# EasyEDA Pro project ProPrj_arm_can_tool_2026-04-18.epro, schematic Schematic1, sheet 3 of 3

## Sheets
3 P3: Page Name: P3; Update Date: 2026-04-16
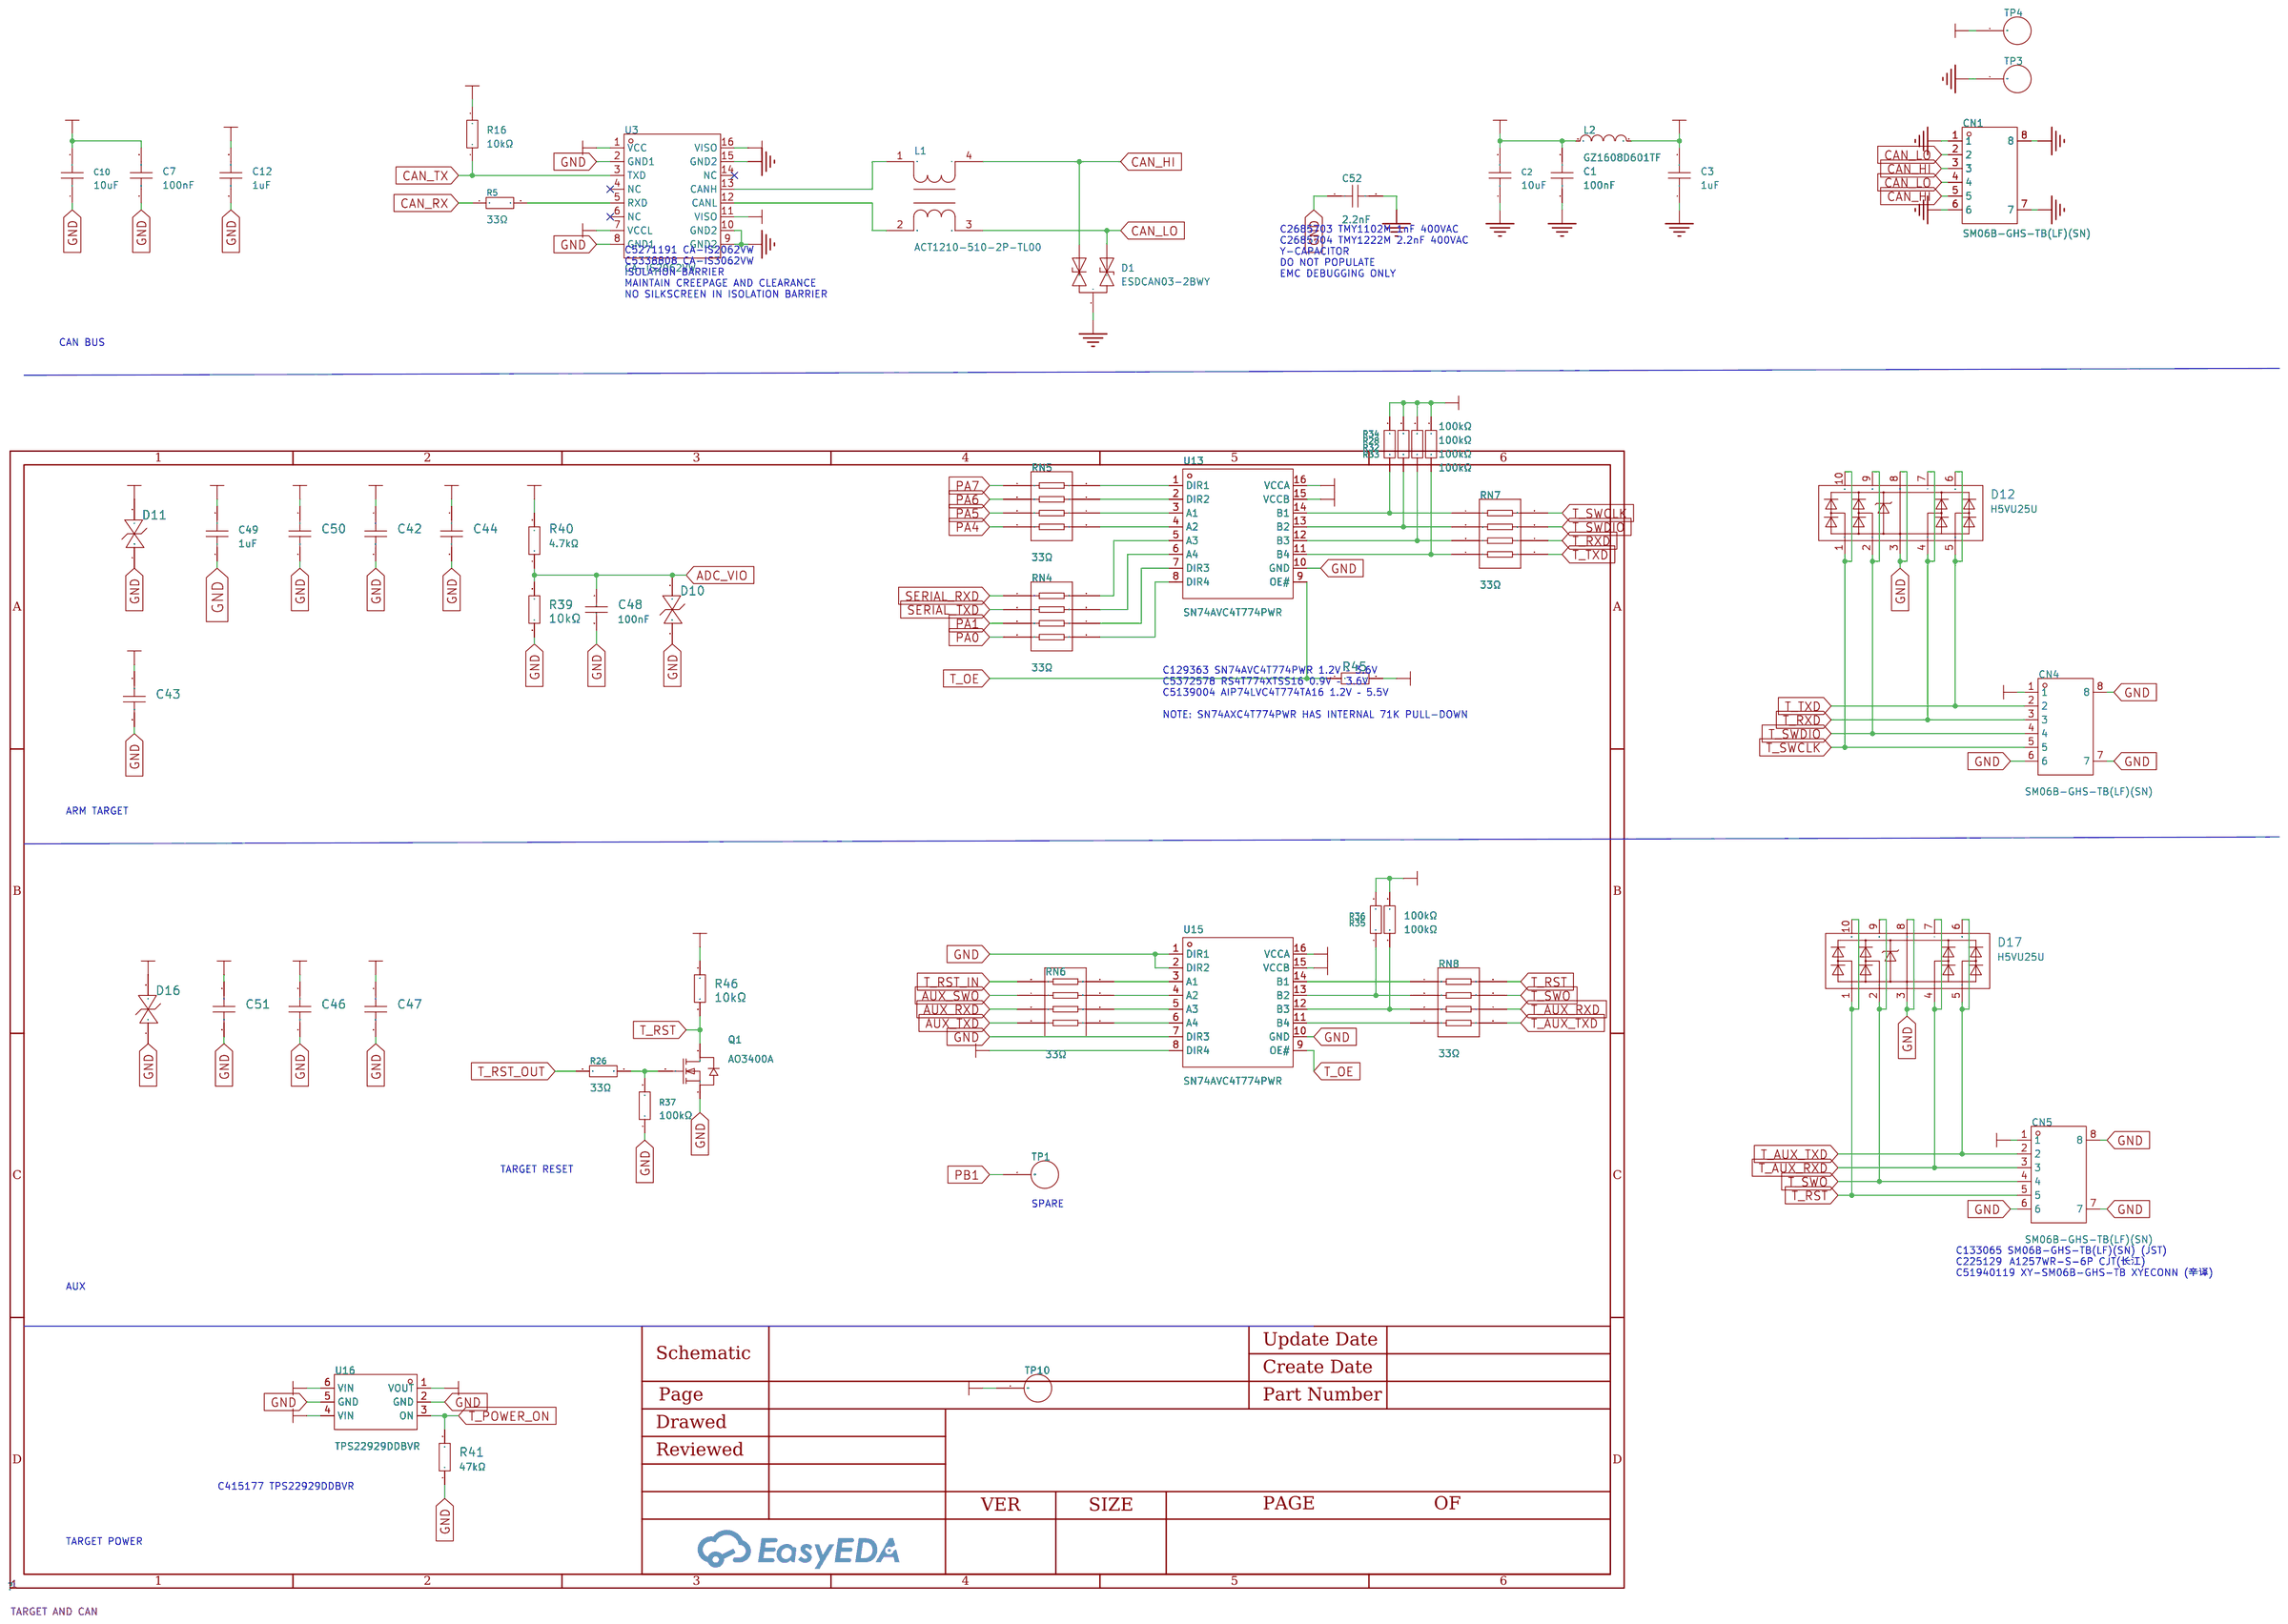
[diagram p2: P3]

## Parts
C1  100nF  [C0603]
C2  10uF  [C0603]
C3  1uF  [C0603]
C7  100nF  [C0603]
C10  10uF  [C0603]
C12  1uF  [C0603]
C42  100nF  [C0402]
C43  100nF  [C0402]
C44  100nF  [C0402]
C46  100nF  [C0402]
C47  100nF  [C0402]
C48  100nF  [C0402]
C49  1uF  [C0402]
C50  100nF  [C0402]
C51  100nF  [C0402]
C52  2.2nF  [CAP-SMD_L7.8-W5.4-P9.60_TMY1222M]  (no BOM)
CN1  SM06B-GHS-TB(LF)(SN)  [CONN-TH_SM06B-GHS-TB-LF-SN]
CN4  SM06B-GHS-TB(LF)(SN)  [CONN-TH_SM06B-GHS-TB-LF-SN]
CN5  SM06B-GHS-TB(LF)(SN)  [CONN-TH_SM06B-GHS-TB-LF-SN]
D1  ESDCAN03-2BWY  [SOT-323-3_L2.0-W1.3-P1.30-LS2.1-BR]
D10  H5VL10B  [SOD-882_L1.0-W0.6-BI]
D11  H5VL10B  [SOD-882_L1.0-W0.6-BI]
D12  H5VU25U  [DFN2510-10_L2.5-W1.0-P0.50-BL]
D16  H5VL10B  [SOD-882_L1.0-W0.6-BI]
D17  H5VU25U  [DFN2510-10_L2.5-W1.0-P0.50-BL]
L1  ACT1210-510-2P-TL00  [FILTER-SMD_4P-L3.2-W2.5-BL_ACT1210]
L2  GZ1608D601TF  [L0603]
Q1  AO3400A  [SOT-23-3_L2.9-W1.3-P1.90-LS2.4-BR]
R5  33Ω  [R0402]
R16  10kΩ  [R0402]
R26  33Ω  [R0402]
R28  100kΩ  [R0402]
R32  100kΩ  [R0402]
R33  100kΩ  [R0402]
R34  100kΩ  [R0402]
R35  100kΩ  [R0402]
R36  100kΩ  [R0402]
R37  100kΩ  [R0402]
R39  10kΩ  [R0402]
R40  4.7kΩ  [R0402]
R41  47kΩ  [R0402]
R45  10kΩ  [R0402]
R46  10kΩ  [R0402]
RN4  33Ω  [RES-ARRAY-SMD_0402-8P-L2.0-W1.0-BL]
RN5  33Ω  [RES-ARRAY-SMD_0402-8P-L2.0-W1.0-BL]
RN6  33Ω  [RES-ARRAY-SMD_0402-8P-L2.0-W1.0-BL]
RN7  33Ω  [RES-ARRAY-SMD_0402-8P-L2.0-W1.0-BL]
RN8  33Ω  [RES-ARRAY-SMD_0402-8P-L2.0-W1.0-BL]
TP1  -  [TEST PAD]  (no BOM)
TP3  -  [TEST PAD]  (no BOM)
TP4  -  [TEST PAD]  (no BOM)
TP10  -  [TEST PAD]  (no BOM)
U3  CA-IS2062VW  [CA-IS305XW]
U13  SN74AVC4T774PWR  [TSSOP-16_L5.0-W4.4-P0.65-LS6.4-BL]
U15  SN74AVC4T774PWR  [TSSOP-16_L5.0-W4.4-P0.65-LS6.4-BL]
U16  TPS22929DDBVR  [SOT-23-6_L2.9-W1.6-P0.95-LS2.8-BL]

## Library data of the parts
C1 C7 = CC0603KRX7R9BB104: Capacitance: Tolerance:±10% Tolerance:±10% Voltage Rated: Temperature Coefficient:; LCSC Part Name: 100nF ±10% 50V; Supplier Part: C14663; Manufacturer: YAGEO(国巨); Supplier Footprint: 0603; JLCPCB Part Class: Basic Part; Datasheet: https://atta.szlcsc.com/upload/public/pdf/source/20180910/C282072_33301C7F631E79921B82A8DAC6BCC5B3.pdf; Supplier: LCSC; Tolerance: ±10%; Check: false
C2 C10 = CL10A106MA8NRNC: Capacitance: Tolerance:±20% Tolerance:±20% Voltage Rated: Temperature Coefficient:; LCSC Part Name: 10uF ±20% 25V; Supplier Part: C96446; Manufacturer: SAMSUNG(三星); Supplier Footprint: 0603; JLCPCB Part Class: Basic Part; Datasheet: https://atta.szlcsc.com/upload/public/pdf/source/20160218/1457707763339.pdf; Supplier: LCSC; Tolerance: ±20%; Check: false
C3 C12 = CL10A105KB8NNNC: Capacitance: Tolerance:±10% Tolerance:±10% Voltage Rated: Temperature Coefficient:; LCSC Part Name: 1uF ±10% 50V; Supplier Part: C15849; Manufacturer: SAMSUNG(三星); Supplier Footprint: 0603; JLCPCB Part Class: Basic Part; Datasheet: https://atta.szlcsc.com/upload/public/pdf/source/20160218/1457707763339.pdf; Supplier: LCSC; Tolerance: ±10%; Check: false
C42-C44 C46-C48 C50 C51 = CL05B104KO5NNNC: Capacitance: Tolerance:±10% Tolerance:±10% Voltage Rated: Temperature Coefficient:; LCSC Part Name: 100nF ±10% 16V; Supplier Part: C1525; Manufacturer: SAMSUNG(三星); Supplier Footprint: 0402; JLCPCB Part Class: Basic Part; Datasheet: https://atta.szlcsc.com/upload/public/pdf/source/20160218/1457707763339.pdf; Supplier: LCSC; Tolerance: ±10%; Check: false
C49 = CL05A105KA5NQNC: Capacitance: Tolerance:±10% Tolerance:±10% Voltage Rated: Temperature Coefficient:; LCSC Part Name: 1uF ±10% 25V; Supplier Part: C52923; Manufacturer: SAMSUNG(三星); Supplier Footprint: 0402; JLCPCB Part Class: Basic Part; Datasheet: https://atta.szlcsc.com/upload/public/pdf/source/20160218/1457707763339.pdf; Supplier: LCSC; Tolerance: ±10%; Check: false
C52 = TMY1222M: Capacitance:2.2nF Tolerance:±20% Tolerance:±20% Voltage(AC):400V Ratings:Y1 Operating Temperature:-40℃~+125℃ Operating Temperature:-40℃~+125℃; LCSC Part Name: 等级:Y1 2.2nF ±20% 400V; Supplier Part: C2685704; Manufacturer: TRX(特锐祥); Supplier Footprint: SMD,5.4x7.8mm; JLCPCB Part Class: Extended Part; Datasheet: https://item.szlcsc.com/datasheet/TMY1222M/2785659.html; Supplier: LCSC; Tolerance: ±20%; Voltage(AC): 400V; Ratings: Y1; Operating Temperature: -40℃~+125℃; Check: false
CN1 CN4 CN5 = SM06B-GHS-TB(LF)(SN): Pins Structure:1x6P Pitch:1.25mm Mounting Style:Horizontal attachment Reference Series:GH Number of Pins:6P Number of Rows:1 Number of PINs Per Row:6 Row Spacing:- Current Rating (Max):1A Contact Material:Phosphor Bronze Contact Plating:Tin Operating Temp; LCSC Part Name: 1x6P 间距:1.25mm 卧贴 系列:GH; Supplier Part: C133065; Manufacturer: JST; Supplier Footprint: SMD,P=1.25mm,卧贴; JLCPCB Part Class: Extended Part; Datasheet: https://atta.szlcsc.com/upload/public/pdf/source/20180323/112205B2CF875947C9562BFC7B01FA26.pdf; Supplier: LCSC; Pins Structure: 1x6P; Pitch: 1.25mm; Mounting Style: Horizontal attachment; Reference Series: GH; Number of Pins: 6P; Number of Rows: 1; Number of PINs Per Row: 6; Current Rating (Max): 1A; Contact Material: Phosphor Bronze; Contact Plating: Tin; Operating Temperature Range: -25℃~+85℃; Rated Voltage (Max): 50V; Plastic Material: PA9T; Flame Retardant Rating: UL94V-0; Supplementary Features: Auxiliary soldering legs; Colour: White; Z-Height of the Board: 4.25mm; X-Length of Bottom Edge on Board (Spacing Line): 10.75mm; Y-Width of Bottom Edge on Board: 4.13mm; Check: false
D1 = ESDCAN03-2BWY: Reverse Stand-Off Voltage (Vrwm):24V Maximum Clamping Voltage:41V Peak Pulse Current (Ipp):3A@8/20us Peak Pulse Power Dissipation (Ppp):250W Breakdown Voltage:26.5V Number of Lines:Dual channel Operating Temperature:-55℃~+175℃@(Tj) Operating Temperature:-; LCSC Part Name: ESDCAN03 2BWY; Supplier Part: C1973833; Manufacturer: ST(意法半导体); Supplier Footprint: SOT-323-3; JLCPCB Part Class: Extended Part; Datasheet: https://atta.szlcsc.com/upload/public/pdf/source/20210601/EE22EC2D769ED57BA217B6DB28AAC84F.pdf; Supplier: LCSC; Reverse Stand-Off Voltage (Vrwm): 24V; Maximum Clamping Voltage: 41V; Peak Pulse Current (Ipp): 3A@8/20us; Peak Pulse Power Dissipation (Ppp): 250W; Breakdown Voltage: 26.5V; Number of Lines: Dual channel; Operating Temperature: -55℃~+175℃@(Tj); Type: ESD; Check: false
D10 D11 D16 = H5VL10B: polarity:Bi-Directional Reverse Stand-Off Voltage (Vrwm):5V Maximum Clamping Voltage:10V Peak Pulse Current (Ipp)@10/1000us:5A Peak Pulse Power Dissipation (Ppp)@10/1000us:50W Breakdown Voltage:5.6V Reverse Leakage Current (Ir):100nA Number of Lines:单路 Op; Supplier Part: C7420372; Manufacturer: 宏迦橙; Supplier Footprint: DFN1006-2L; JLCPCB Part Class: Extended Part; Datasheet: https://atta.szlcsc.com/upload/public/pdf/source/20230630/5024ECFEAD3C9801B07A8DBB967AB462.pdf; Supplier: LCSC; polarity: Bi-Directional; Reverse Stand-Off Voltage (Vrwm): 5V; Maximum Clamping Voltage: 10V; Peak Pulse Current (Ipp)@10/1000us: 5A; Peak Pulse Power Dissipation (Ppp)@10/1000us: 50W; Breakdown Voltage: 5.6V; Reverse Leakage Current (Ir): 100nA; Number of Lines: 单路; Operating Temperature: -55℃~+155℃; Type: TVS; Check: false
D12 D17 = H5VU25U: polarity:Unidirectional Reverse Stand-Off Voltage (Vrwm):5V Maximum Clamping Voltage:14V Peak Pulse Current (Ipp)@10/1000us:4A Peak Pulse Power Dissipation (Ppp)@10/1000us:56W Breakdown Voltage:6V Reverse Leakage Current (Ir):1uA Number of Lines:Quad Oper; Supplier Part: C7420374; Manufacturer: 宏迦橙; Supplier Footprint: DFN2510-10L; JLCPCB Part Class: Extended Part; Datasheet: https://atta.szlcsc.com/upload/public/pdf/source/20230630/91FD1DB17AB88B6832D3039FAE61FF10.pdf; Supplier: LCSC; polarity: Unidirectional; Reverse Stand-Off Voltage (Vrwm): 5V; Maximum Clamping Voltage: 14V; Peak Pulse Current (Ipp)@10/1000us: 4A; Peak Pulse Power Dissipation (Ppp)@10/1000us: 56W; Breakdown Voltage: 6V; Reverse Leakage Current (Ir): 1uA; Number of Lines: Quad; Operating Temperature: -55℃~+155℃; Type: TVS; Check: false
L1 = ACT1210-510-2P-TL00: Number of Lines:2 Current Rating:200mA Inductance @ Frequency:51uH@100kHz Voltage Rating - DC:80V Impedance @ Frequency:2.6kΩ@10MHz DC Resistance(DCR):700mΩ Operating Temperature:-55℃~+150℃ Operating Temperature:-55℃~+150℃; LCSC Part Name: 两路 共模滤波器 阻抗2.6kΩ@10MHz; Supplier Part: C95572; Manufacturer: TDK; Supplier Footprint: SMD-4P,3.2x2.5mm; JLCPCB Part Class: Extended Part; Datasheet: https://item.szlcsc.com/datasheet/ACT1210-510-2P-TL00/96776.html; Supplier: LCSC; Number of Lines: 2; Current Rating: 200mA; Inductance @ Frequency: 51uH@100kHz; Voltage Rating - DC: 80V; Impedance @ Frequency: 2.6kΩ@10MHz; DC Resistance(DCR): 700mΩ; Operating Temperature: -55℃~+150℃; Check: false
L2 = GZ1608D601TF: Impedance @ Frequency:600Ω@100MHz Tolerance:±25% Tolerance:±25% DC Resistance:450mΩ Current Rating:200mA Circuits:1; LCSC Part Name: 单路 0603磁珠 阻抗600Ω@100MHz; Supplier Part: C1002; Manufacturer: Sunlord(顺络); Supplier Footprint: 0603; JLCPCB Part Class: Basic Part; Datasheet: https://atta.szlcsc.com/upload/public/pdf/source/20241120/893429B990C3BA07384E734821D2F218.pdf; Supplier: LCSC; Impedance @ Frequency: 600Ω@100MHz; Tolerance: ±25%; DC Resistance: 450mΩ; Current Rating: 200mA; Circuits: 1; Check: false
Q1 = AO3400A_C20917: Type:1 N-Channel Drain Source Voltage (Vdss): Continuous Drain Current (Id): Power Dissipation (Pd): Drain Source On Resistance (RDS(on)@Vgs,Id):26.5mΩ@10V,5.7A Gate Threshold Voltage (Vgs(th)@Id):1.5V@250uA Total Gate Charge (Qg@Vgs):7nC@4.5V Input Capac; LCSC Part Name: 1个N沟道 耐压:30V 电流:5.7A; Supplier Part: C20917; Manufacturer: AOS; Supplier Footprint: SOT-23-3L; JLCPCB Part Class: Basic Part; Datasheet: https://atta.szlcsc.com/upload/public/pdf/source/20140107/1457706668533.pdf; Supplier: LCSC; Type: 1 N-Channel; Drain Source On Resistance (RDS(on)@Vgs,Id): 26.5mΩ@10V,5.7A; Gate Threshold Voltage (Vgs(th)@Id): 1.5V@250uA; Total Gate Charge (Qg@Vgs): 7nC@4.5V; Input Capacitance (Ciss@Vds): 630pF@15V; Operating Temperature: -55℃~+150℃@(Tj); Check: false
R5 R26 = 0402WGF330JTCE: Type:Thick Film Resistors Resistance:33Ω Tolerance:±1% Tolerance:±1% Power(Watts): Overload Voltage (Max): Temperature Coefficient:±100ppm/℃ Temperature Coefficient:±100ppm/℃ Operating Temperature Range:-55℃~+155℃ Operating Temperature Range:-55℃~+155℃; LCSC Part Name: 33Ω ±1% 62.5mW 厚膜电阻; Supplier Part: C25105; Manufacturer: UNI-ROYAL(厚声); Supplier Footprint: 0402; JLCPCB Part Class: Basic Part; Datasheet: https://atta.szlcsc.com/upload/public/pdf/source/20200306/C422600_1E6D84923E4A46A82E41ADD87F860B5C.pdf; Supplier: LCSC; Type: Thick Film Resistors; Tolerance: ±1%; Temperature Coefficient: ±100ppm/℃; Operating Temperature Range: -55℃~+155℃; Check: false
R16 R45 = 0402WGF1002TCE: Type:Thick Film Resistor Resistance:10kΩ Tolerance:±1% Tolerance:±1% Power(Watts):62.5mW Voltage-Supply(Max):50V Temperature Coefficient:±100ppm/℃ Temperature Coefficient:±100ppm/℃ Operating Temperature:-55℃~+155℃ Operating Temperature:-55℃~+155℃; LCSC Part Name: 10kΩ ±1% 62.5mW 厚膜电阻; Supplier Part: C25744; Manufacturer: UNI-ROYAL(厚声); Supplier Footprint: 0402; JLCPCB Part Class: Basic Part; Datasheet: https://item.szlcsc.com/datasheet/0402WGF1002TCE/26487.html; Supplier: LCSC; Tolerance: ±1%; Power(Watts): 62.5mW; Temperature Coefficient: ±100ppm/℃; Type: Thick Film Resistor; Operating Temperature Range: -55℃~+155℃; Voltage-Supply(Max): 50V; Operating Temperature: -55℃~+155℃; Check: false
R28 R32-R37 = 0402WGF1003TCE: Resistance:100000Ω Tolerance:±1% Tolerance:±1% Power(Watts): Overload Voltage (Max): Temperature Coefficient:±100ppm/℃ Temperature Coefficient:±100ppm/℃ Type:Thick Film Resistors Operating Temperature Range:-55℃~+155℃ Operating Temperature Range:-55℃~+155; LCSC Part Name: 100kΩ ±1% 62.5mW 厚膜电阻; Supplier Part: C25741; Manufacturer: UNI-ROYAL(厚声); Supplier Footprint: 0402; JLCPCB Part Class: Basic Part; Datasheet: https://atta.szlcsc.com/upload/public/pdf/source/20200306/C422600_1E6D84923E4A46A82E41ADD87F860B5C.pdf; Supplier: LCSC; Tolerance: ±1%; Temperature Coefficient: ±100ppm/℃; Type: Thick Film Resistors; Operating Temperature Range: -55℃~+155℃; Check: false
R39 R46 = 0402WGF1002TCE: Type:Thick Film Resistor Resistance:10kΩ Tolerance:±1% Tolerance:±1% Power(Watts):62.5mW Voltage-Supply(Max):50V Temperature Coefficient:±100ppm/℃ Temperature Coefficient:±100ppm/℃ Operating Temperature:-55℃~+155℃ Operating Temperature:-55℃~+155℃; LCSC Part Name: 10kΩ ±1% 62.5mW 厚膜电阻; Supplier Part: C25744; Manufacturer: UNI-ROYAL(厚声); Supplier Footprint: 0402; JLCPCB Part Class: Basic Part; Datasheet: https://atta.szlcsc.com/upload/public/pdf/source/20200306/C422600_1E6D84923E4A46A82E41ADD87F860B5C.pdf; Supplier: LCSC; Tolerance: ±1%; Power(Watts): 62.5mW; Temperature Coefficient: ±100ppm/℃; Type: Thick Film Resistors; Operating Temperature Range: -55℃~+155℃; Voltage-Supply(Max): 50V; Operating Temperature: -55℃~+155℃; Check: false
R40 = 0402WGF4701TCE: Resistance:4700Ω Tolerance:±1% Tolerance:±1% Power(Watts): Overload Voltage (Max): Temperature Coefficient:±100ppm/℃ Temperature Coefficient:±100ppm/℃ Type:Thick Film Resistors Operating Temperature Range:-55℃~+155℃ Operating Temperature Range:-55℃~+155℃; LCSC Part Name: 4.7kΩ ±1% 62.5mW 厚膜电阻; Supplier Part: C25900; Manufacturer: UNI-ROYAL(厚声); Supplier Footprint: 0402; JLCPCB Part Class: Basic Part; Datasheet: https://atta.szlcsc.com/upload/public/pdf/source/20200306/C422600_1E6D84923E4A46A82E41ADD87F860B5C.pdf; Supplier: LCSC; Tolerance: ±1%; Temperature Coefficient: ±100ppm/℃; Type: Thick Film Resistors; Operating Temperature Range: -55℃~+155℃; Check: false
R41 = 0402WGF4702TCE: Resistance:47000Ω Tolerance:±1% Tolerance:±1% Power(Watts): Overload Voltage (Max): Temperature Coefficient:±100ppm/℃ Temperature Coefficient:±100ppm/℃ Type:Thick Film Resistors Operating Temperature Range:-55℃~+155℃ Operating Temperature Range:-55℃~+155℃; LCSC Part Name: 47kΩ ±1% 62.5mW 厚膜电阻; Supplier Part: C25792; Manufacturer: UNI-ROYAL(厚声); Supplier Footprint: 0402; JLCPCB Part Class: Basic Part; Datasheet: https://atta.szlcsc.com/upload/public/pdf/source/20200306/C422600_1E6D84923E4A46A82E41ADD87F860B5C.pdf; Supplier: LCSC; Tolerance: ±1%; Temperature Coefficient: ±100ppm/℃; Type: Thick Film Resistors; Operating Temperature Range: -55℃~+155℃; Check: false
RN4-RN8 = YC124-FR-0733RL: Number of Resistors: Resistance: Tolerance:±1% Tolerance:±1% Power(Watts): Temperature Coefficient:±200ppm/℃ Temperature Coefficient:±200ppm/℃ Number of Pins:; LCSC Part Name: 33Ω ±1% 0402x4; Supplier Part: C136851; Manufacturer: YAGEO(国巨); Supplier Footprint: 0402x4; JLCPCB Part Class: Extended Part; Datasheet: https://atta.szlcsc.com/upload/public/pdf/source/20180730/C256814_200CCA6CC84D78D7E49AE6680727F338.pdf; Supplier: LCSC; Tolerance: ±1%; Temperature Coefficient: ±200ppm/℃; Check: false
TP1 TP3 TP4 TP10 = TEST PAD: Check: false
U3 = CA-IS2062VW: Data Rate(Max):1Mbps Voltage - Supply:4.5V~5.5V Voltage - Supply:4.5V~5.5V Integrated Power Output Voltage:4.75V~5.25V Integrated Power Output Voltage:4.75V~5.25V Isolation Voltage(Vrms):3750 CMTI(kV/us):150kV/us Operating Temperature:-40℃~+125℃ Operating; Supplier Part: C5271191; Manufacturer: Chipanalog(川土微); Supplier Footprint: SOIC-16; JLCPCB Part Class: Extended Part; Datasheet: https://atta.szlcsc.com/upload/public/pdf/source/20240126/A4F7156900B0DEB7A0F3B90F6549B2FA.pdf; Supplier: LCSC; Data Rate(Max): 1Mbps; Voltage - Supply: 4.5V~5.5V; Integrated Power Output Voltage: 4.75V~5.25V; Isolation Voltage(Vrms): 3750; CMTI(kV/us): 150kV/us; Operating Temperature: -40℃~+125℃; Check: false
U13 U15 = SN74AVC4T774PWR: Supplier Part: C129363; Manufacturer: TI(德州仪器); Supplier Footprint: TSSOP-16; JLCPCB Part Class: Extended Part; Datasheet: https://www.ti.com/cn/lit/gpn/sn74avc4t774; Supplier: LCSC; Check: false
U16 = TPS22929DDBVR: Number of Outputs:1 Output Current:1.8A Input Voltage:1.4V~5.5V Input Voltage:1.4V~5.5V Resistor On-State:115mΩ Operating Temperature-:-40℃~+85℃ Operating Temperature-:-40℃~+85℃; Supplier Part: C415177; Manufacturer: TI(德州仪器); Supplier Footprint: SOT-23-6; JLCPCB Part Class: Extended Part; Datasheet: https://www.ti.com/cn/lit/gpn/tps22929d; Supplier: LCSC; Number of Outputs: 1; Output Current: 1.8A; Input Voltage: 1.4V~5.5V; Resistor On-State: 115mΩ; Operating Temperature	-: -40℃~+85℃; Check: false

## Nets
3.3V: C12.2 C43.1 C47.1 R16.2 R45.2 U3.7(VCCL) U13.16(VCCA) U15.8(DIR4) U15.16(VCCA) U16.4(VIN) U16.6(VIN) ; also on sheet 1 2
5V: C7.2 C10.2 U3.1(VCC) ; also on sheet 1 2
GND: C7.1 C10.1 C12.1 C42.2 C43.2 C44.2 C46.2 C47.2 C48.2 C49.1 C50.2 C51.2 C52.1 CN4.6 CN4.7 CN4.8 CN5.6 CN5.7 CN5.8 D10.1(C) D11.1(C) D12.3 D12.8 D16.1(C) D17.3 D17.8 Q1.2(S) R37.1 R39.1 R41.1 U3.2(GND1) U3.8(GND1) U13.10(GND) U15.1(DIR1) U15.2(DIR2) U15.7(DIR3) U15.10(GND) U16.2(GND) U16.5(GND) ; also on sheet 1 2
ADC_VIO: C48.1 D10.2(A) R39.2 R40.1 ; also on sheet 1
AUX_RXD: RN6.6 ; also on sheet 1
AUX_SWO: RN6.7 ; also on sheet 1
AUX_TXD: RN6.5 ; also on sheet 1
CAN_5V_IN: C3.2 L2.2 TP4.1(TEST_PAD1) U3.11(VISO)
CAN_5V_OUT: C1.2 C2.2 L2.1 U3.16(VISO)
CAN_GND: C1.1 C2.1 C3.1 C52.2 CN1.1 CN1.6 CN1.7 CN1.8 D1.3(K) TP3.1(TEST_PAD1) U3.9(GND2) U3.10(GND2) U3.15(GND2) ; also on sheet 1
CAN_HI: CN1.3 CN1.5 D1.2(A) L1.4
CAN_LO: CN1.2 CN1.4 D1.1(A) L1.3
CAN_RX: R5.1 ; also on sheet 1
CAN_RX_INT: R5.2 U3.5(RXD)
CAN_TX: R16.1 U3.3(TXD) ; also on sheet 1
PA0: RN4.1 ; also on sheet 1
PA1: RN4.2 ; also on sheet 1
PA4: RN5.1 ; also on sheet 1
PA5: RN5.2 ; also on sheet 1
PA6: RN5.3 ; also on sheet 1
PA7: RN5.4 ; also on sheet 1
PB1: TP1.1(TEST_PAD1) ; also on sheet 1
SERIAL_RXD: RN4.4 ; also on sheet 1
SERIAL_TXD: RN4.3 ; also on sheet 1
T_AUX_RXD: CN5.3 D17.4 D17.7 RN8.7
T_AUX_TXD: CN5.2 D17.5 D17.6 RN8.8
T_OE: R45.1 U13.9(OE#) U15.9(OE#) ; also on sheet 1
T_POWER_ON: R41.2 U16.3(ON) ; also on sheet 1
T_RST: CN5.5 D17.1 D17.10 Q1.3(D) R46.2 RN8.5
T_RST_IN: RN6.8 ; also on sheet 1
T_RST_OUT: R26.1 ; also on sheet 1
T_RXD: CN4.3 D12.4 D12.7 RN7.7
T_SWCLK: CN4.5 D12.1 D12.10 RN7.5
T_SWDIO: CN4.4 D12.2 D12.9 RN7.6
T_SWO: CN5.4 D17.2 D17.9 RN8.6
T_TXD: CN4.2 D12.5 D12.6 RN7.8
VIO: C42.1 C44.1 C46.1 C49.2 C50.1 C51.1 CN4.1 CN5.1 D11.2(A) D16.2(A) R28.2 R32.2 R33.2 R34.2 R35.2 R36.2 R40.2 R46.1 TP10.1(TEST_PAD1) U13.15(VCCB) U15.15(VCCB) U16.1(VOUT)
$3N4347: R32.1 RN7.2 U13.12(B3)
$3N4348: R33.1 RN7.1 U13.11(B4)
$3N4349: R28.1 RN7.3 U13.13(B2)
$3N4350: R34.1 RN7.4 U13.14(B1)
$3N4403: RN5.5 U13.1(DIR1)
$3N4404: RN5.6 U13.2(DIR2)
$3N4405: RN5.7 U13.3(A1)
$3N4406: RN5.8 U13.4(A2)
$3N4411: RN4.5 U13.5(A3)
$3N4412: RN4.6 U13.6(A4)
$3N4413: RN4.7 U13.7(DIR3)
$3N4414: RN4.8 U13.8(DIR4)
$3N5227: RN8.1 U15.11(B4)
$3N5228: R35.1 RN8.2 U15.12(B3)
$3N5229: R36.1 RN8.3 U15.13(B2)
$3N5230: RN8.4 U15.14(B1)
$3N5450: Q1.1(G) R26.2 R37.2
$3N53774: L1.1 U3.13(CANH)
$3N53786: L1.2 U3.12(CANL)
$3N86563: RN6.1 U15.3(A1)
$3N86568: RN6.2 U15.4(A2)
$3N86573: RN6.3 U15.5(A3)
$3N86578: RN6.4 U15.6(A4)

Not connected (* = marked no-connect by the designer): U3 4(NC)* 6(NC)* 14(NC)*

## Notes on the sheets
sheet 3
- C2685703 TMY1102M 1nF 400VAC
  C2685704 TMY1222M 2.2nF 400VAC
  Y-CAPACITOR
  DO NOT POPULATE
  EMC DEBUGGING ONLY
- C5271191 CA-IS2062VW
  C5338808 CA-IS3062VW
  ISOLATION BARRIER
  MAINTAIN CREEPAGE AND CLEARANCE
  NO SILKSCREEN IN ISOLATION BARRIER
- CAN BUS
- C129363 SN74AVC4T774PWR 1.2V – 3.6V
  C5372578 RS4T774XTSS16 0.9V – 3.6V
  C5139004 AIP74LVC4T774TA16 1.2V – 5.5V
  NOTE: SN74AXC4T774PWR HAS INTERNAL 71K PULL-DOWN
- ARM TARGET
- TARGET RESET
- SPARE
- C133065 SM06B-GHS-TB(LF)(SN) (JST)
  C225129	A1257WR-S-6P CJT(长江)
  C51940119 XY-SM06B-GHS-TB XYECONN (辛译)
- AUX
- C415177 TPS22929DDBVR
- TARGET POWER
